# EasyEDA Pro project ProPrj_Space_Weight_2026-05-02.epro

# Schematic Schematic1
Board Name: Board1; Create Date: 2026-02-28; Page Name: P1; Project Name: Space_Weight; Schematic Name: Schematic1; Update Date: 2026-02-28; Company: EasyEDA.com; Page Size: A4; Version: V1.0
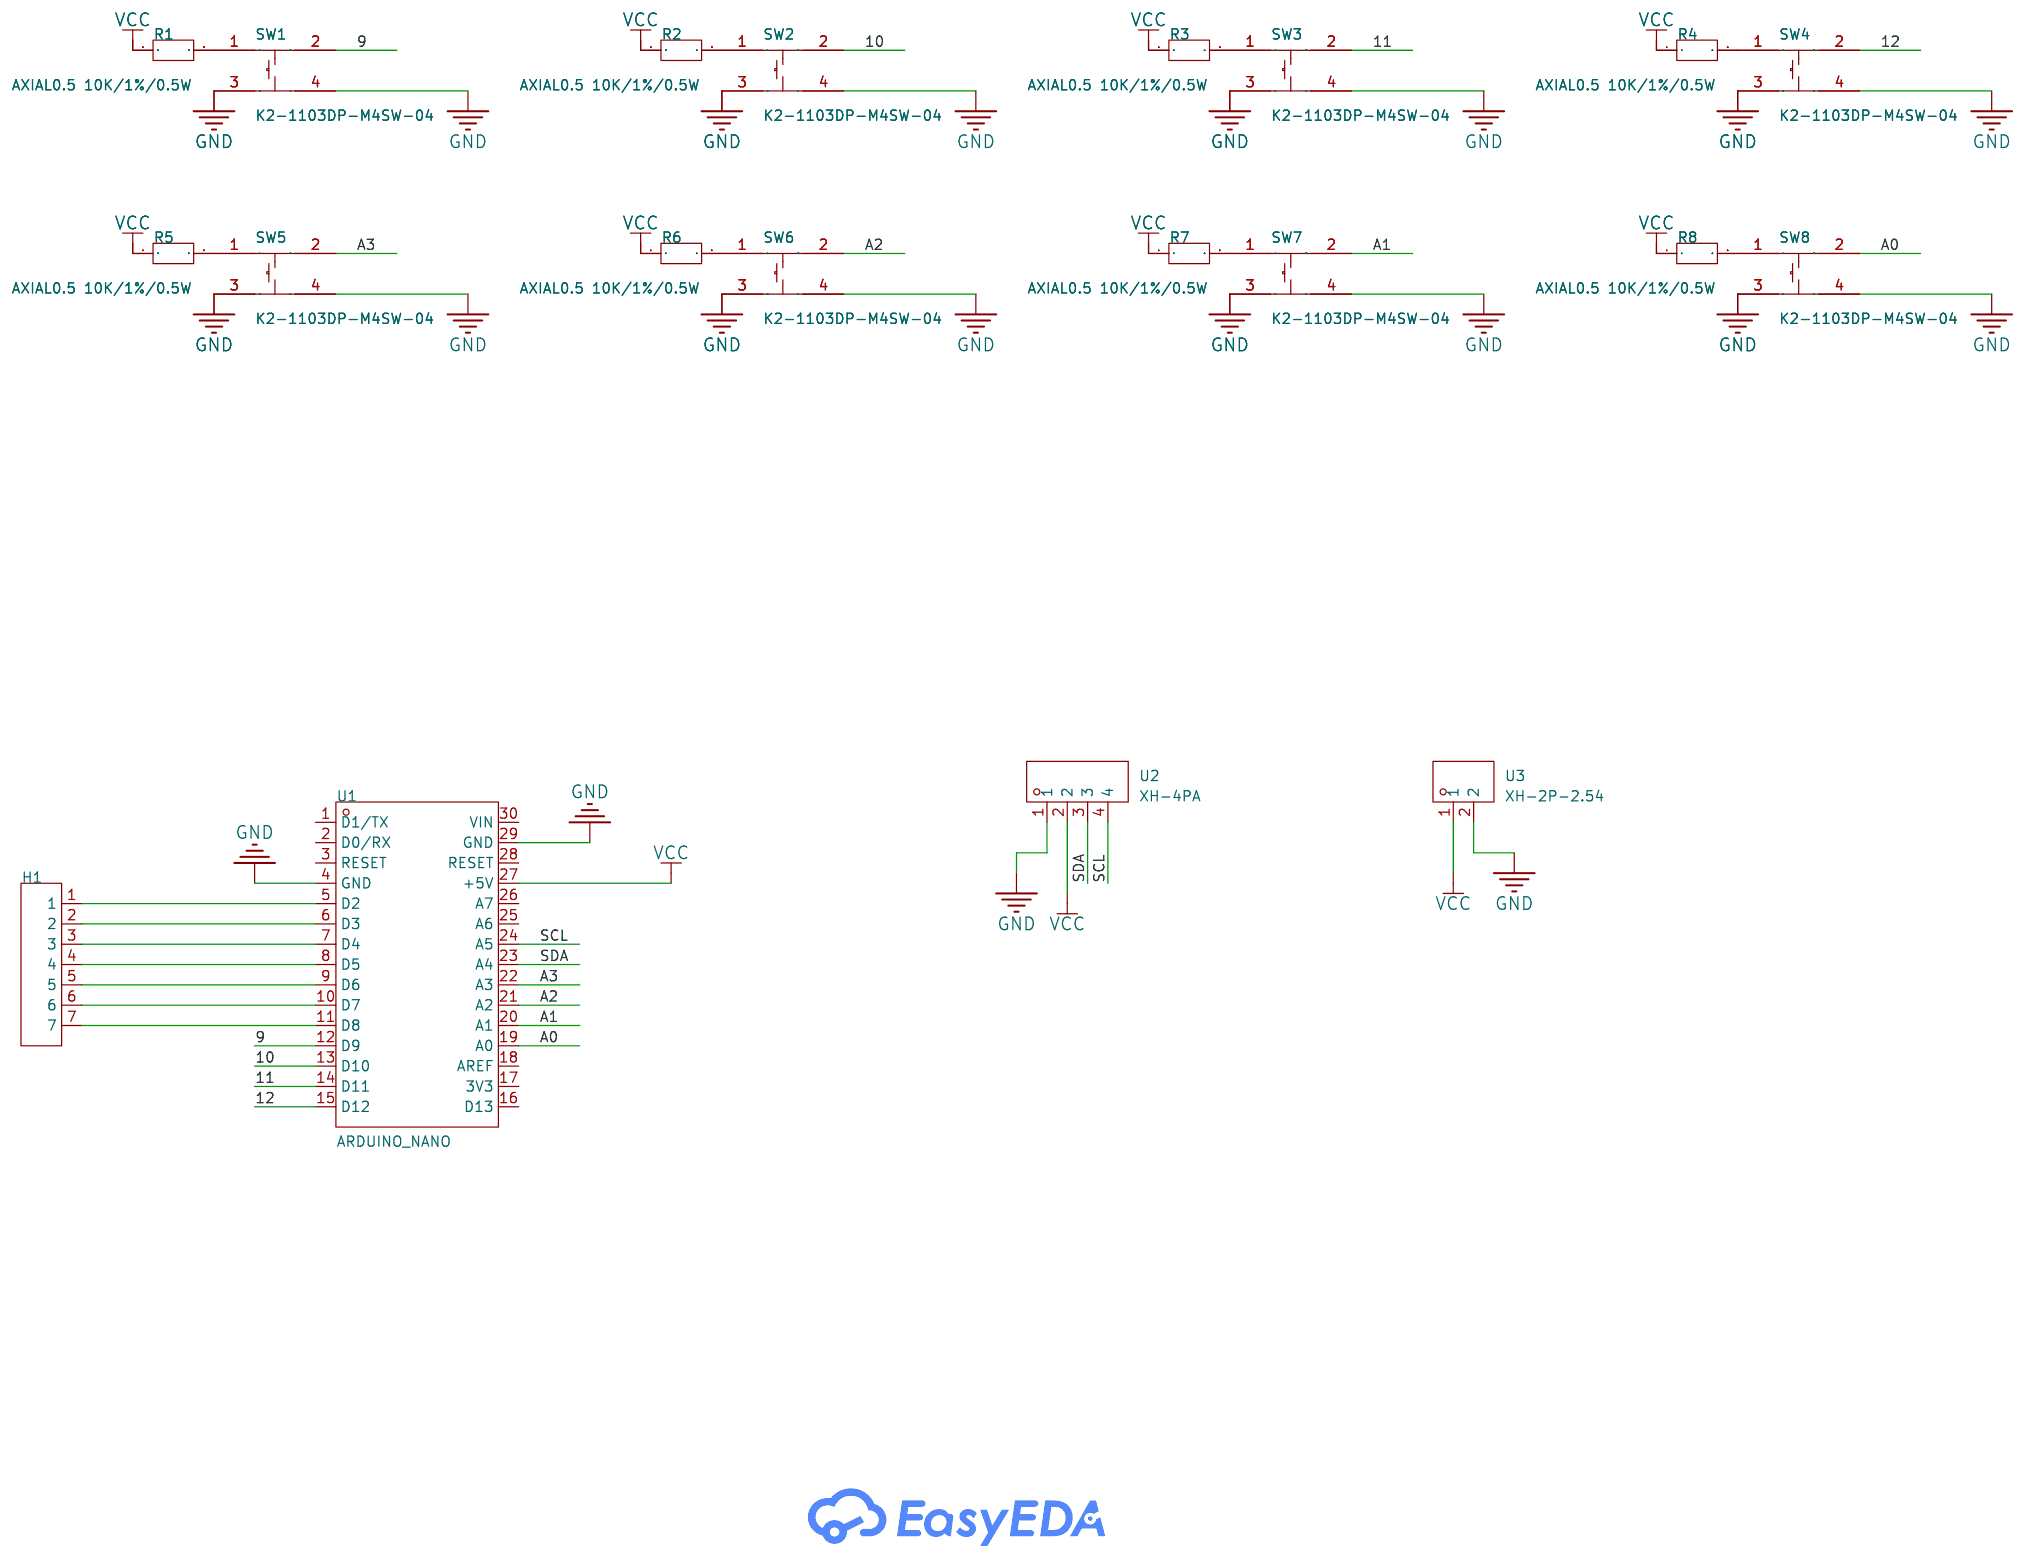
[diagram p0: schematic sheet]

## Parts
H1  -  [HDR-TH_7P-P2.54-V-M]
R1  AXIAL0.5 10K/1%/0.5W  [RES-TH_BD3.0-L9.0-P13.0-D0.6]
R2  AXIAL0.5 10K/1%/0.5W  [RES-TH_BD3.0-L9.0-P13.0-D0.6]
R3  AXIAL0.5 10K/1%/0.5W  [RES-TH_BD3.0-L9.0-P13.0-D0.6]
R4  AXIAL0.5 10K/1%/0.5W  [RES-TH_BD3.0-L9.0-P13.0-D0.6]
R5  AXIAL0.5 10K/1%/0.5W  [RES-TH_BD3.0-L9.0-P13.0-D0.6]
R6  AXIAL0.5 10K/1%/0.5W  [RES-TH_BD3.0-L9.0-P13.0-D0.6]
R7  AXIAL0.5 10K/1%/0.5W  [RES-TH_BD3.0-L9.0-P13.0-D0.6]
R8  AXIAL0.5 10K/1%/0.5W  [RES-TH_BD3.0-L9.0-P13.0-D0.6]
SW1  K2-1103DP-M4SW-04  [SW-TH_4P-L12.0-W12.0-P5.00-LS12.5_TC-1103XX]
SW2  K2-1103DP-M4SW-04  [SW-TH_4P-L12.0-W12.0-P5.00-LS12.5_TC-1103XX]
SW3  K2-1103DP-M4SW-04  [SW-TH_4P-L12.0-W12.0-P5.00-LS12.5_TC-1103XX]
SW4  K2-1103DP-M4SW-04  [SW-TH_4P-L12.0-W12.0-P5.00-LS12.5_TC-1103XX]
SW5  K2-1103DP-M4SW-04  [SW-TH_4P-L12.0-W12.0-P5.00-LS12.5_TC-1103XX]
SW6  K2-1103DP-M4SW-04  [SW-TH_4P-L12.0-W12.0-P5.00-LS12.5_TC-1103XX]
SW7  K2-1103DP-M4SW-04  [SW-TH_4P-L12.0-W12.0-P5.00-LS12.5_TC-1103XX]
SW8  K2-1103DP-M4SW-04  [SW-TH_4P-L12.0-W12.0-P5.00-LS12.5_TC-1103XX]
U1  ARDUINO_NANO  [COMM-TH_ARDUINO_NANO]
U2  XH-4PA  [CONN-TH_4P-P2.50_ZHOURI_XH-4PA]
U3  XH-2P-2.54  [CONN-TH_2P-P2.50-XH2.54-2P]

## Library data of the parts
H1 = HDR-M_2.54_1x7P: Supplier Footprint: Through
R1-R8 = AXIAL0.5 10K/1%/0.5W: Supplier Part: C9900018936; Supplier Footprint: 10K/1%/0.5W; JLCPCB Part Class: Extended Part; Supplier: LCSC
SW1-SW8 = K2-1103DP-M4SW-04: Supplier Part: C136702; Supplier Footprint: 12x12mm; JLCPCB Part Class: Extended Part; Supplier: LCSC
U1 = ARDUINO_NANO: Supplier Part: C9900017879; Supplier Footprint: 插件; JLCPCB Part Class: Extended Part; Supplier: LCSC
U2 = XH-4PA: Pins Structure:1x4P Pitch:2.5mm Mounting Type:Through Hole Number of Pins:4P Number of Rows:1 Number of PINs Per Row:4 Current Rating:3A Operating Temperature:-25℃~+85℃ Operating Temperature:-25℃~+85℃ Voltage Rating:250V Plastic Material:PA66 Z-Height of; LCSC Part Name: 1x4P 间距:2.5mm 直插; Supplier Part: C5258885; Manufacturer: ZHOURI(洲日); Supplier Footprint: 插件,P=2.5mm; JLCPCB Part Class: Extended Part; Datasheet: https://item.szlcsc.com/datasheet/XH-4PA/5978916.html; Supplier: LCSC; Pins Structure: 1x4P; Pitch: 2.5mm; Mounting Type: Through Hole; Number of Pins: 4P; Number of Rows: 1; Number of PINs Per Row: 4; Current Rating: 3A; Operating Temperature: -25℃~+85℃; Voltage Rating: 250V; Plastic Material: PA66; Z-Height of the Board: 7mm; X-Length of Bottom Edge on Board (Spacing Line): 12.5mm; Y-Width of Bottom Edge on Board: 5.7mm
U3 = XH-2P-2.54: Supplier Part: C9900003929; Supplier Footprint: TH-2P; JLCPCB Part Class: Extended Part; Supplier: LCSC

## Nets
GND: SW1.3 SW1.4 SW2.3 SW2.4 SW3.3 SW3.4 SW4.3 SW4.4 SW5.3 SW5.4 SW6.3 SW6.4 SW7.3 SW7.4 SW8.3 SW8.4 U1.4(GND) U1.29(GND) U2.1 U3.2
VCC: R1.1 R2.1 R3.1 R4.1 R5.1 R6.1 R7.1 R8.1 U1.27(+5V) U2.2 U3.1
9: SW1.2 U1.12(D9)
10: SW2.2 U1.13(D10)
11: SW3.2 U1.14(D11)
12: SW4.2 U1.15(D12)
A0: SW8.2 U1.19(A0)
A1: SW7.2 U1.20(A1)
A2: SW6.2 U1.21(A2)
A3: SW5.2 U1.22(A3)
SCL: U1.24(A5) U2.4
SDA: U1.23(A4) U2.3
$1N1055: H1.1 U1.5(D2)
$1N1057: H1.2 U1.6(D3)
$1N1059: H1.3 U1.7(D4)
$1N1061: H1.4 U1.8(D5)
$1N1063: H1.5 U1.9(D6)
$1N1065: H1.6 U1.10(D7)
$1N1067: H1.7 U1.11(D8)
Net-(R1-2): R1.2 SW1.1
Net-(R2-2): R2.2 SW2.1
Net-(R3-2): R3.2 SW3.1
Net-(R4-2): R4.2 SW4.1
Net-(R5-2): R5.2 SW5.1
Net-(R6-2): R6.2 SW6.1
Net-(R7-2): R7.2 SW7.1
Net-(R8-2): R8.2 SW8.1

Not connected (* = marked no-connect by the designer): U1 1(D1/TX) 2(D0/RX) 3(RESET) 16(D13) 17(3V3) 18(AREF) 25(A6) 26(A7) 28(RESET) 30(VIN)

# Board PCB1
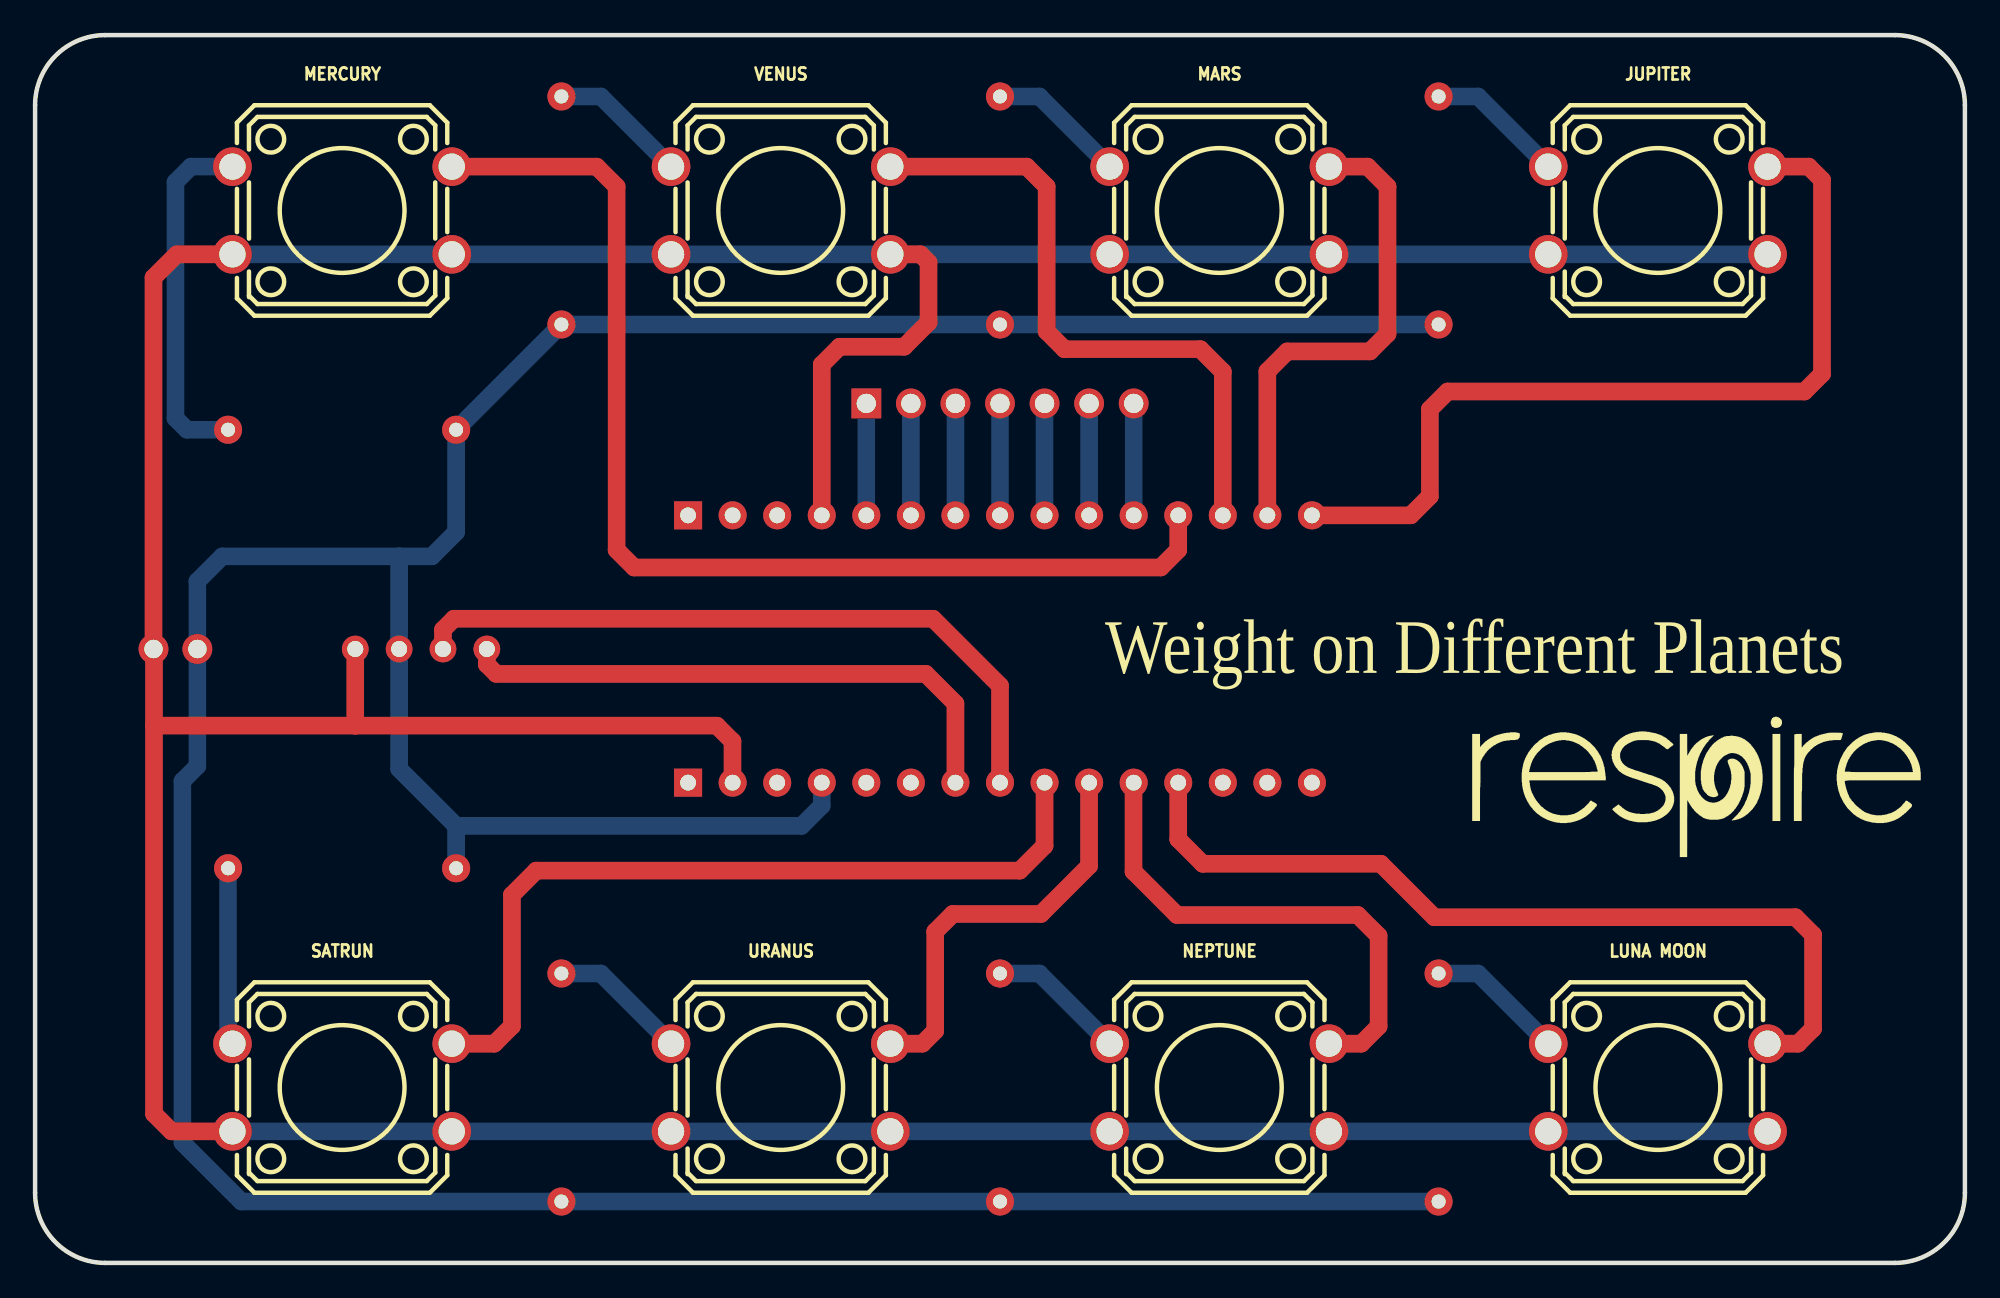
[diagram p1: board, top side]
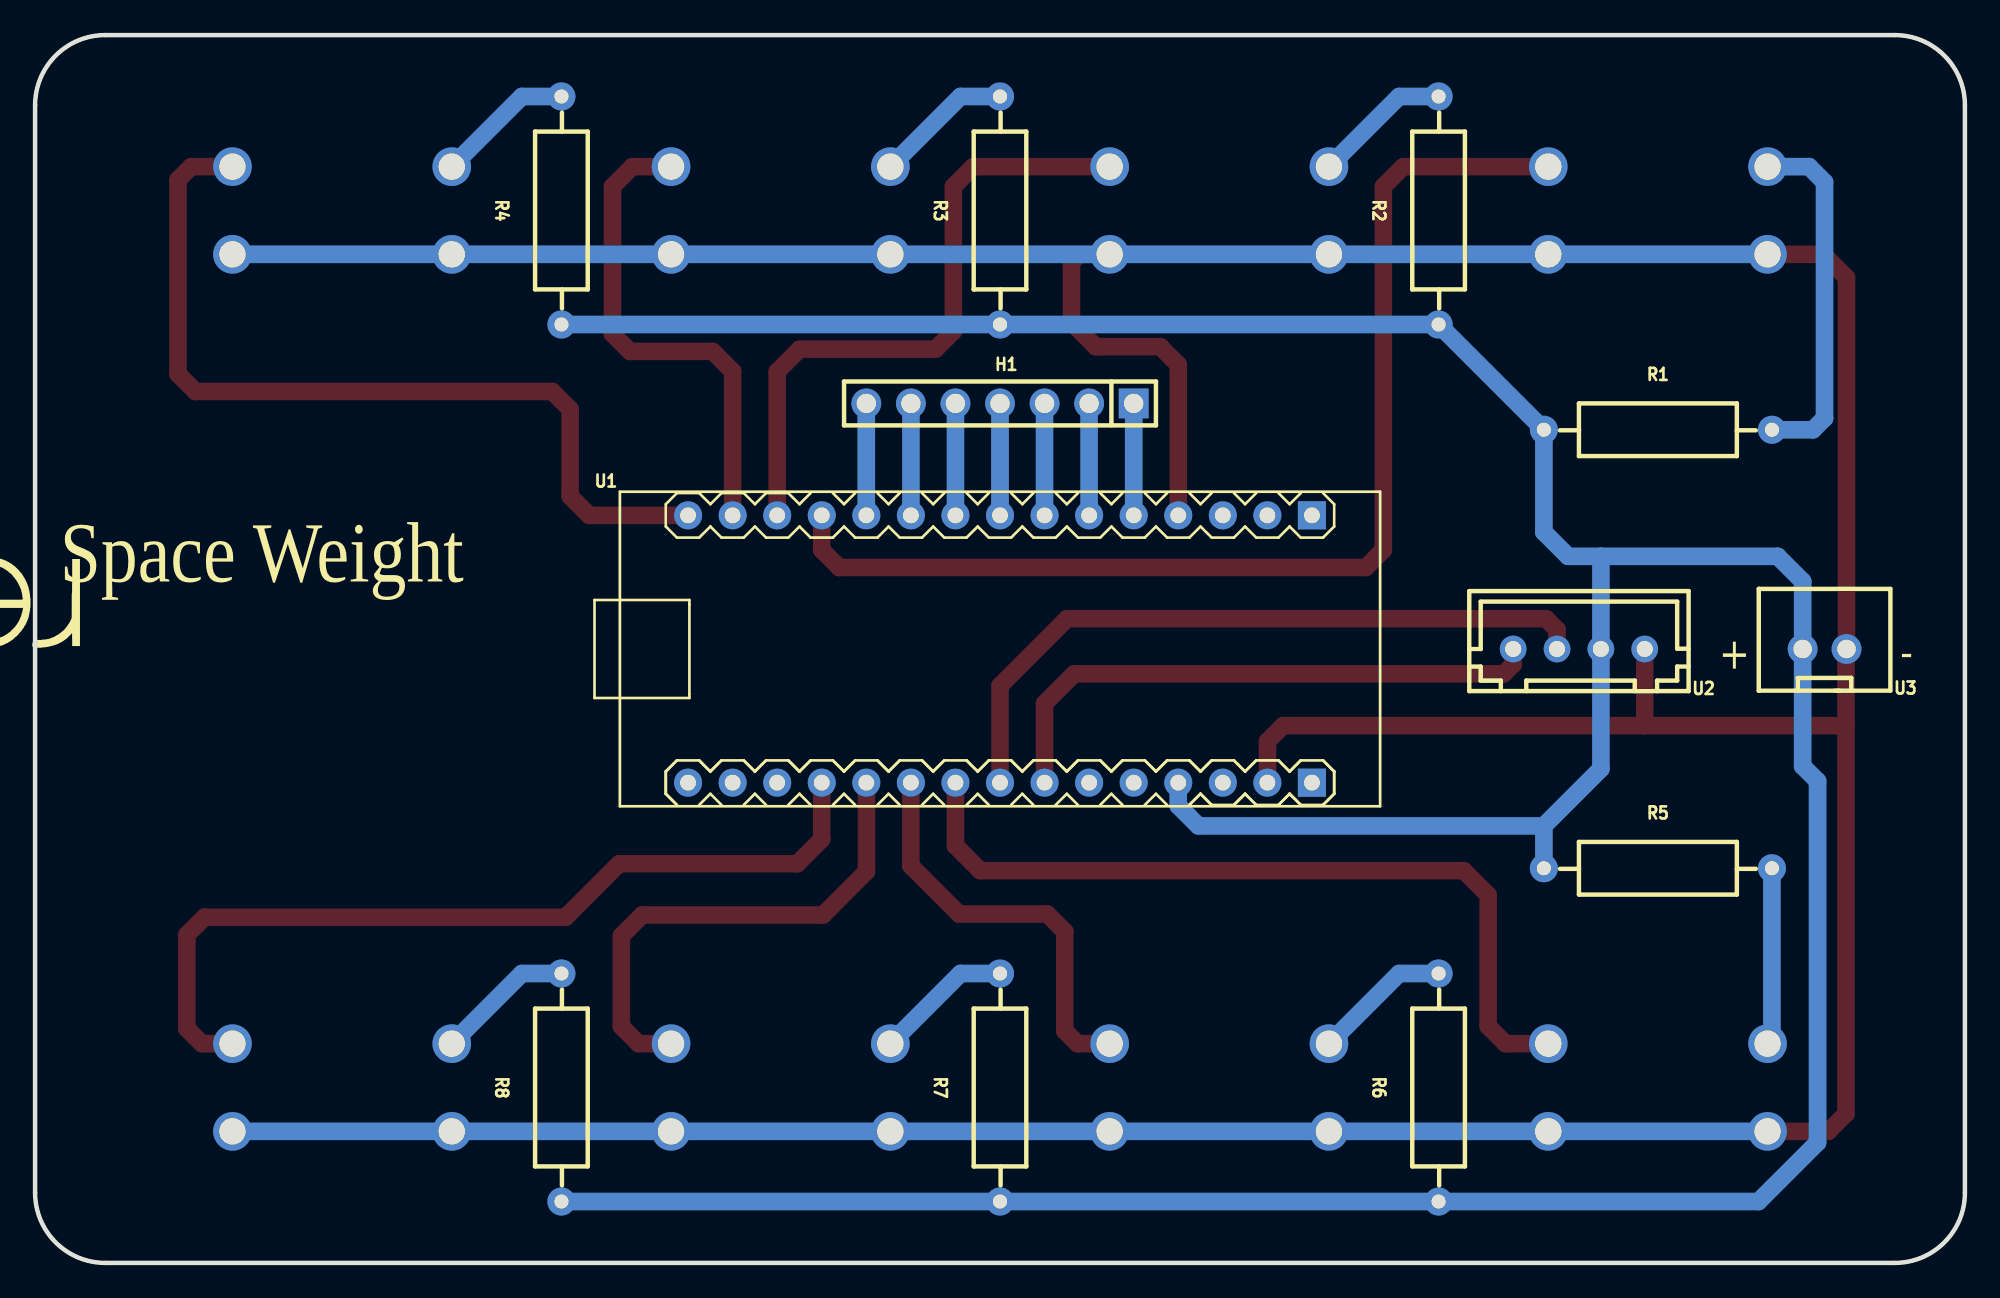
[diagram p2: board, bottom side, seen from below]

Outline 110 x 70 mm; copper layers: Top Layer, Bottom Layer. Coordinates in mm from the lower left corner of the outline.
Outline path: 0,66 0,4 arc(1.17,1.17) 4,0 106,0 arc(108.83,1.17) 110,4 110,66 arc(108.83,68.83) 106,70 4,70 arc(1.17,68.83) 0,66
Stack: Top Layer 0.035mm / Dielectric1 1.51mm FR4 er 4.5 / Bottom Layer 0.035mm

## Design rules (mm)
template: Custom Config
spacing copperThickness1oz (default): track to track 0.102, other pairs 0.152 to 0.3
spacing copperThickness2oz: track to track 0.203, other pairs 0.152 to 0.3
track width copperThickness1oz (default): min 0.127, default 1, max 2.54
track width copperThickness2oz: min 0.203, default 1, max 2.54
differential pair differentialPair (default): width min 0.127, default 0.254, max 2.54; gap min 0.152, default 0.152
via viaSize (default): diameter min 0.5, default 0.61, max 10; hole min 0.3, default 0.305, max 6.3

## Placement (name value [footprint] x y rotation side)
H1  -  [HDR-TH_7P-P2.54-V-M]  55 49 0 bottom
JUPITER  K2-1103DP-M4SW-04  [SW-TH_4P-L12.0-W12.0-P5.00-LS12.5_TC-1103XX]  92.5 60 0 top
LUNA MOON  K2-1103DP-M4SW-04  [SW-TH_4P-L12.0-W12.0-P5.00-LS12.5_TC-1103XX]  92.5 10 0 top
MARS  K2-1103DP-M4SW-04  [SW-TH_4P-L12.0-W12.0-P5.00-LS12.5_TC-1103XX]  67.5 60 0 top
MERCURY  K2-1103DP-M4SW-04  [SW-TH_4P-L12.0-W12.0-P5.00-LS12.5_TC-1103XX]  17.5 60 0 top
NEPTUNE  K2-1103DP-M4SW-04  [SW-TH_4P-L12.0-W12.0-P5.00-LS12.5_TC-1103XX]  67.5 10 0 top
R1  AXIAL0.5 10K/1%/0.5W  [RES-TH_BD3.0-L9.0-P13.0-D0.6]  17.5 47.5 180 bottom
R2  AXIAL0.5 10K/1%/0.5W  [RES-TH_BD3.0-L9.0-P13.0-D0.6]  30 60 90 bottom
R3  AXIAL0.5 10K/1%/0.5W  [RES-TH_BD3.0-L9.0-P13.0-D0.6]  55 60 90 bottom
R4  AXIAL0.5 10K/1%/0.5W  [RES-TH_BD3.0-L9.0-P13.0-D0.6]  80 60 90 bottom
R5  AXIAL0.5 10K/1%/0.5W  [RES-TH_BD3.0-L9.0-P13.0-D0.6]  17.5 22.5 180 bottom
R6  AXIAL0.5 10K/1%/0.5W  [RES-TH_BD3.0-L9.0-P13.0-D0.6]  30 10 90 bottom
R7  AXIAL0.5 10K/1%/0.5W  [RES-TH_BD3.0-L9.0-P13.0-D0.6]  55 10 90 bottom
R8  AXIAL0.5 10K/1%/0.5W  [RES-TH_BD3.0-L9.0-P13.0-D0.6]  80 10 90 bottom
SATRUN  K2-1103DP-M4SW-04  [SW-TH_4P-L12.0-W12.0-P5.00-LS12.5_TC-1103XX]  17.5 10 0 top
U1  ARDUINO_NANO  [COMM-TH_ARDUINO_NANO]  55 35 180 bottom
U2  XH-4PA  [CONN-TH_4P-P2.50_ZHOURI_XH-4PA]  22 35 0 bottom
U3  XH-2P-2.54  [CONN-TH_2P-P2.50-XH2.54-2P]  8 35 0 bottom
URANUS  K2-1103DP-M4SW-04  [SW-TH_4P-L12.0-W12.0-P5.00-LS12.5_TC-1103XX]  42.5 10 0 top
VENUS  K2-1103DP-M4SW-04  [SW-TH_4P-L12.0-W12.0-P5.00-LS12.5_TC-1103XX]  42.5 60 0 top

## Footprints (pads in the part's own frame, mm; a bottom-side part is the same pattern mirrored in y, then rotated)
COMM-TH_ARDUINO_NANO
  rect 1.6x1.6 hole 0.9: 1(17.78,7.62) 30(17.78,-7.62)
  round 1.6 hole 0.9: 2(15.24,7.62) 3(12.7,7.62) 4(10.16,7.62) 5(7.62,7.62) 6(5.08,7.62) 7(2.54,7.62) 8(0,7.62) 9(-2.54,7.62) 10(-5.08,7.62) 11(-7.62,7.62) 12(-10.16,7.62) 13(-12.7,7.62) 14(-15.24,7.62) 15(-17.78,7.62) 16(-17.78,-7.62) 17(-15.24,-7.62) 18(-12.7,-7.62) 19(-10.16,-7.62) 20(-7.62,-7.62) 21(-5.08,-7.62) 22(-2.54,-7.62) 23(0,-7.62) 24(2.54,-7.62) 25(5.08,-7.62) 26(7.62,-7.62) 27(10.16,-7.62) 28(12.7,-7.62) 29(15.24,-7.62)
CONN-TH_2P-P2.50-XH2.54-2P
  round 1.7 hole 1.05: 1(1.25,0) 2(-1.25,0)
CONN-TH_4P-P2.50_ZHOURI_XH-4PA
  round 1.524 hole 0.914: 1(-3.75,0) 2(-1.25,0) 3(1.25,0) 4(3.75,0)
HDR-TH_7P-P2.54-V-M
  rect 1.7x1.7 hole 1.1: 1(-7.62,0)
  round 1.7 hole 1.1: 2(-5.08,0) 3(-2.54,0) 4(0,0) 5(2.54,0) 6(5.08,0) 7(7.62,0)
RES-TH_BD3.0-L9.0-P13.0-D0.6
  round 1.6 hole 0.8: 1(-6.5,0) 2(6.5,0)
SW-TH_4P-L12.0-W12.0-P5.00-LS12.5_TC-1103XX
  round 2.2 hole 1.5: 1(-6.25,2.5) 2(6.25,2.5) 3(-6.25,-2.5) 4(6.25,-2.5)

## Nets
GND: JUPITER.3 JUPITER.4 LUNA MOON.3 LUNA MOON.4 MARS.3 MARS.4 MERCURY.3 MERCURY.4 NEPTUNE.3 NEPTUNE.4 SATRUN.3 SATRUN.4 U1.4 U1.29 U2.1 U3.2 URANUS.3 URANUS.4 VENUS.3 VENUS.4
VCC: R1.1 R2.1 R3.1 R4.1 R5.1 R6.1 R7.1 R8.1 U1.27 U2.2 U3.1
9: MERCURY.2 U1.12
10: U1.13 VENUS.2
11: MARS.2 U1.14
12: JUPITER.2 U1.15
A0: LUNA MOON.2 U1.19
A1: NEPTUNE.2 U1.20
A2: U1.21 URANUS.2
A3: SATRUN.2 U1.22
SCL: U1.24 U2.4
SDA: U1.23 U2.3
$1N1055: H1.1 U1.5
$1N1057: H1.2 U1.6
$1N1059: H1.3 U1.7
$1N1061: H1.4 U1.8
$1N1063: H1.5 U1.9
$1N1065: H1.6 U1.10
$1N1067: H1.7 U1.11
$1N1238: MERCURY.1 R1.2
$1N1370: R2.2 VENUS.1
$1N1402: MARS.1 R3.2
$1N1434: JUPITER.1 R4.2
$1N1466: R5.2 SATRUN.1
$1N1498: R6.2 URANUS.1
$1N1530: NEPTUNE.1 R7.2
$1N1562: LUNA MOON.1 R8.2

Pads without a net: U1 1 2 3 16 17 18 25 26 28 30

## Routing (per net, layer and track width the routed paths; a pad name or vN(x,y) marks a point on that pad's centre or on a via; arc(x,y) is an arc through that point)
GND: length 294.2
  Top Layer w1: SATRUN.3 7.78,7.5 6.78,8.5 6.78,30.63 ; U1.29 39.75,27.39 39.75,29.74 38.86,30.63 18.25,30.63 ; 6.78,30.63 18.25,30.63 ; 6.78,30.63 6.78,34.97 U3.2 6.75,56.18 8.07,57.5 MERCURY.3 ; 18.25,30.63 U2.1 ; VENUS.4 50.47,57.5 50.93,57.05 50.93,53.62 49.54,52.23 45.86,52.23 44.84,51.21 U1.4
  Bottom Layer w1: LUNA MOON.4 LUNA MOON.3 NEPTUNE.4 NEPTUNE.3 URANUS.4 URANUS.3 SATRUN.4 SATRUN.3 ; MERCURY.3 MERCURY.4 VENUS.3 VENUS.4 MARS.3 MARS.4 JUPITER.3 JUPITER.4
VCC: length 227.3
  Bottom Layer w1: 24,24.92 20.75,28.17 U2.2 20.75,40.28 ; 24,24.92 43.69,24.92 44.84,26.07 U1.27 ; 24,24.92 R5.1 ; 20.75,40.28 10.67,40.28 9.25,38.86 U3.1 9.25,28.32 8.4,27.47 8.4,6.87 11.76,3.5 R6.1 R7.1 R8.1 ; 20.75,40.28 22.62,40.28 24,41.66 R1.1 R2.1 R3.1 R4.1
9: length 65.4
  Top Layer w1: MERCURY.2 32.01,62.5 33.15,61.36 33.15,40.65 34.15,39.65 64.16,39.65 65.16,40.65 U1.12
10: length 36.8
  Top Layer w1: VENUS.2 56.52,62.5 57.66,61.36 57.66,53.11 58.67,52.09 66.42,52.09 67.7,50.81 U1.13
11: length 28.2
  Top Layer w1: MARS.2 75.95,62.5 77.09,61.36 77.09,52.97 76.09,51.97 71.37,51.97 70.24,50.83 U1.14
12: length 49.8
  Top Layer w1: JUPITER.2 101.1,62.5 101.85,61.75 101.85,50.68 100.85,49.68 80.52,49.68 79.5,48.66 79.5,43.71 78.41,42.62 U1.15
A0: length 50
  Top Layer w1: LUNA MOON.2 100.49,12.5 101.35,13.36 101.35,18.71 100.35,19.71 79.76,19.71 76.71,22.76 66.56,22.76 65.16,24.15 U1.19
A1: length 29
  Top Layer w1: U1.20 62.61,27.37 62.61,22.31 65.09,19.83 75.39,19.83 76.58,18.64 76.58,13.48 75.6,12.5 NEPTUNE.2
A2: length 23.6
  Top Layer w1: U1.21 60.08,22.64 57.34,19.89 52.31,19.89 51.31,18.89 51.31,13.23 50.58,12.5 URANUS.2
A3: length 46.4
  Top Layer w1: SATRUN.2 26.18,12.5 27.18,13.5 27.18,20.98 28.56,22.36 56.12,22.36 57.54,23.78 U1.22
SCL: length 33
  Top Layer w1: U1.24 52.46,31.89 50.77,33.58 26.29,33.58 25.75,34.12 U2.4
SDA: length 40.2
  Top Layer w1: U1.23 55,32.91 51.18,36.73 23.88,36.73 23.25,36.1 U2.3
$1N1055: length 6.4
  Bottom Layer w1: H1.1 U1.5
$1N1057: length 6.4
  Bottom Layer w1: U1.6 H1.2
$1N1059: length 6.4
  Bottom Layer w1: H1.3 U1.7
$1N1061: length 6.4
  Bottom Layer w1: H1.4 U1.8
$1N1063: length 6.4
  Bottom Layer w1: H1.5 U1.9
$1N1065: length 6.4
  Bottom Layer w1: H1.6 U1.10
$1N1067: length 6.4
  Bottom Layer w1: H1.7 U1.11
$1N1238: length 20.3
  Bottom Layer w1: R1.2 8.66,47.5 8,48.16 8,61.62 8.88,62.5 MERCURY.1
$1N1370: length 7.9
  Bottom Layer w1: R2.2 32.25,66.5 VENUS.1
$1N1402: length 7.9
  Bottom Layer w1: MARS.1 57.25,66.5 R3.2
$1N1434: length 7.9
  Bottom Layer w1: R4.2 82.25,66.5 JUPITER.1
$1N1466: length 10.1
  Bottom Layer w1: R5.2 11,12.75 SATRUN.1
$1N1498: length 7.9
  Bottom Layer w1: R6.2 32.25,16.5 URANUS.1
$1N1530: length 7.9
  Bottom Layer w1: R7.2 57.25,16.5 NEPTUNE.1
$1N1562: length 7.9
  Bottom Layer w1: R8.2 82.25,16.5 LUNA MOON.1

## Text on the board
Bottom Silkscreen Layer: Space Weight | - | +
Top Silkscreen Layer: Weight on Different Planets
